# EAGLE design LED-Lamp-pth (EAGLE 7.5.0)
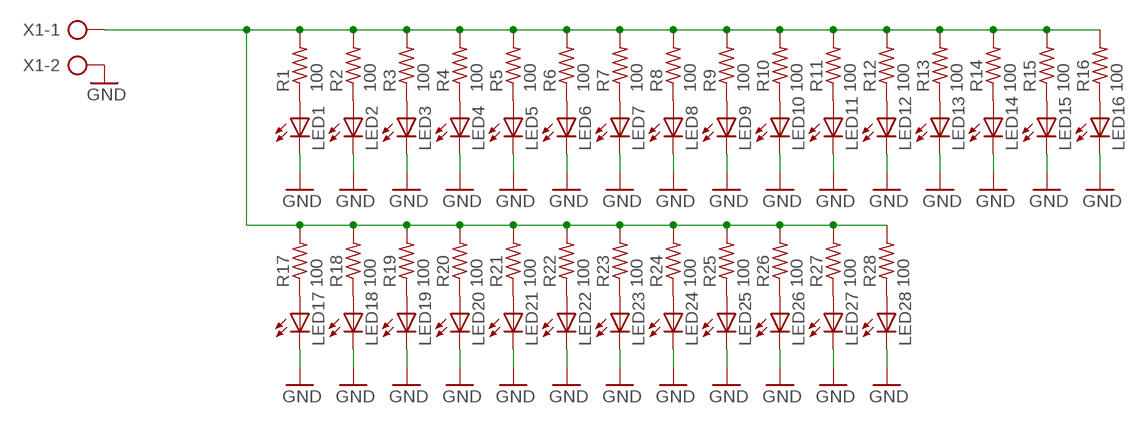
[diagram p0: schematic, sheet 1]

## Parts
LED1  LEDSML0805  [SML0805]
LED2  LEDSML0805  [SML0805]
LED3  LEDSML0805  [SML0805]
LED4  LEDSML0805  [SML0805]
LED5  LEDSML0805  [SML0805]
LED6  LEDSML0805  [SML0805]
LED7  LEDSML0805  [SML0805]
LED8  LEDSML0805  [SML0805]
LED9  LEDSML0805  [SML0805]
LED10  LEDSML0805  [SML0805]
LED11  LEDSML0805  [SML0805]
LED12  LEDSML0805  [SML0805]
LED13  LEDSML0805  [SML0805]
LED14  LEDSML0805  [SML0805]
LED15  LEDSML0805  [SML0805]
LED16  LEDSML0805  [SML0805]
LED17  LEDSML0805  [SML0805]
LED18  LEDSML0805  [SML0805]
LED19  LEDSML0805  [SML0805]
LED20  LEDSML0805  [SML0805]
LED21  LEDSML0805  [SML0805]
LED22  LEDSML0805  [SML0805]
LED23  LEDSML0805  [SML0805]
LED24  LEDSML0805  [SML0805]
LED25  LEDSML0805  [SML0805]
LED26  LEDSML0805  [SML0805]
LED27  LEDSML0805  [SML0805]
LED28  LEDSML0805  [SML0805]
R1  100  R-US_0207/7  [0207/7]
R2  100  R-US_0207/7  [0207/7]
R3  100  R-US_0207/7  [0207/7]
R4  100  R-US_0207/7  [0207/7]
R5  100  R-US_0207/7  [0207/7]
R6  100  R-US_0207/7  [0207/7]
R7  100  R-US_0207/7  [0207/7]
R8  100  R-US_0207/7  [0207/7]
R9  100  R-US_0207/7  [0207/7]
R10  100  R-US_0207/7  [0207/7]
R11  100  R-US_0207/7  [0207/7]
R12  100  R-US_0207/7  [0207/7]
R13  100  R-US_0207/7  [0207/7]
R14  100  R-US_0207/7  [0207/7]
R15  100  R-US_0207/7  [0207/7]
R16  100  R-US_0207/7  [0207/7]
R17  100  R-US_0207/7  [0207/7]
R18  100  R-US_0207/7  [0207/7]
R19  100  R-US_0207/7  [0207/7]
R20  100  R-US_0207/7  [0207/7]
R21  100  R-US_0207/7  [0207/7]
R22  100  R-US_0207/7  [0207/7]
R23  100  R-US_0207/7  [0207/7]
R24  100  R-US_0207/7  [0207/7]
R25  100  R-US_0207/7  [0207/7]
R26  100  R-US_0207/7  [0207/7]
R27  100  R-US_0207/7  [0207/7]
R28  100  R-US_0207/7  [0207/7]
X1  AK300/2  [AK300/2]

## Nets
GND: LED1.C LED2.C LED3.C LED4.C LED5.C LED6.C LED7.C LED8.C LED9.C LED10.C LED11.C LED12.C LED13.C LED14.C LED15.C LED16.C LED17.C LED18.C LED19.C LED20.C LED21.C LED22.C LED23.C LED24.C LED25.C LED26.C LED27.C LED28.C X1.2
N$1: LED1.A R1.1
N$2: LED2.A R2.1
N$3: LED3.A R3.1
N$4: LED4.A R4.1
N$5: R1.2 R2.2 R3.2 R4.2 R5.2 R6.2 R7.2 R8.2 R9.2 R10.2 R11.2 R12.2 R13.2 R14.2 R15.2 R16.2 R17.2 R18.2 R19.2 R20.2 R21.2 R22.2 R23.2 R24.2 R25.2 R26.2 R27.2 R28.2 X1.1
N$6: LED5.A R5.1
N$7: LED6.A R6.1
N$8: LED7.A R7.1
N$9: LED8.A R8.1
N$10: LED9.A R9.1
N$11: LED10.A R10.1
N$12: LED11.A R11.1
N$13: LED12.A R12.1
N$14: LED13.A R13.1
N$15: LED14.A R14.1
N$16: LED15.A R15.1
N$17: LED16.A R16.1
N$18: LED17.A R17.1
N$19: LED18.A R18.1
N$20: LED19.A R19.1
N$21: LED20.A R20.1
N$22: LED21.A R21.1
N$23: LED22.A R22.1
N$24: LED23.A R23.1
N$25: LED24.A R24.1
N$26: LED25.A R25.1
N$28: LED26.A R26.1
N$30: LED27.A R27.1
N$32: LED28.A R28.1

## Library data of the parts
LED1-LED28 = led:LED: LED OSRAM: - CHIPLED LG R971, LG N971, LY N971, LG Q971, LY Q971, LO R971, LY R971 LH N974, LH R974 LS Q976, LO Q976, LY Q976 LO Q996 - Hyper CHIPLED LW Q18S LB Q993, LB Q99A, LB R99A - SideLED LS A670, LO A670, LY A670, LG A670, LP A670 LB A673, LV A673, LT A673, LW A673 LH A674 LY A675 LS A676, LA A676, LO A676, LY A676, LW A676 LS A679, LY A679, LG A679 - Hyper Micro SIDELED® LS Y876, LA Y876, LO Y876, LY Y876 LT Y87S - SmartLED LW L88C, LW L88S LB L89C, LB L89S, LG L890 LS L89K, LO L89K, LY L89K LS L896, LA L896, LO L896, LY L896 - TOPLED LS T670, LO T670, LY T670, LG T670, LP T670 LSG T670, LSP T670, LSY T670, LOP T670, LYG T670 LG T671, LOG T671, LSG T671 LB T673, LV T673, LT T673, LW T673 LH T674 LS T676, LA T676, LO T676, LY T676, LB T676, LH T676, LSB T676, LW T676 LB T67C, LV T67C, LT T67C, LS T67K, LO T67K, LY T67K, LW E67C LS E67B, LA E67B, LO E67B, LY E67B, LB E67C, LV E67C, LT E67C LW T67C LS T679, LY T679, LG T679 LS T770, LO T770, LY T770, LG T770, LP T770 LB T773, LV T773, LT T773, LW T773 LH T774 LS E675, LA E675, LY E675, LS T675 LS T776, LA T776, LO T776, LY T776, LB T776 LHGB T686 LT T68C, LB T68C - Hyper Mini TOPLED® LB M676 - Mini TOPLED Santana® LG M470 LS M47K, LO M47K, LY M47K Source: http://www.osram.convergy.de LUXEON: - LUMILED® LXK2-PW12-R00, LXK2-PW12-S00, LXK2-PW14-U00, LXK2-PW14-V00 LXK2-PM12-R00, LXK2-PM12-S00, LXK2-PM14-U00 LXK2-PE12-Q00, LXK2-PE12-R00, LXK2-PE12-S00, LXK2-PE14-T00, LXK2-PE14-U00 LXK2-PB12-K00, LXK2-PB12-L00, LXK2-PB12-M00, LXK2-PB14-N00, LXK2-PB14-P00, LXK2-PB14-Q00 LXK2-PR12-L00, LXK2-PR12-M00, LXK2-PR14-Q00, LXK2-PR14-R00 LXK2-PD12-Q00, LXK2-PD12-R00, LXK2-PD12-S00 LXK2-PH12-R00, LXK2-PH12-S00 LXK2-PL12-P00, LXK2-PL12-Q00, LXK2-PL12-R00 Source: www.luxeon.com KINGBRIGHT: KA-3528ASYC Source: www.kingbright.com
R1-R28 = rcl:R-US_: RESISTOR, American symbol
X1 = con-ptr500:AK300/2: CONNECTOR; OC_FARNELL: unknown; OC_NEWARK: unknown

## Board
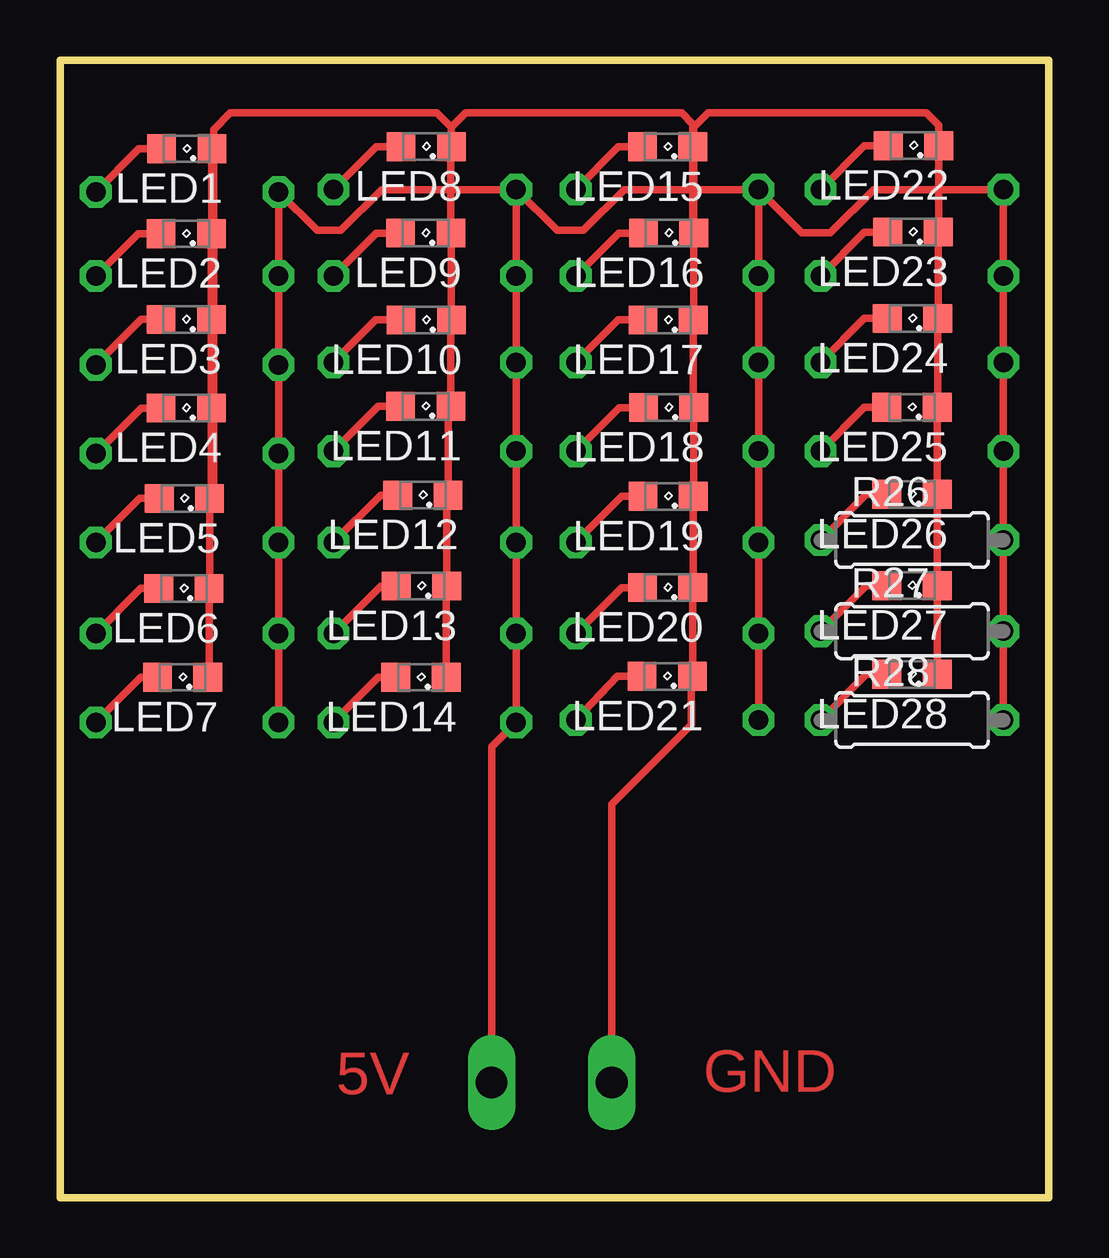
[diagram p1: board, top side]
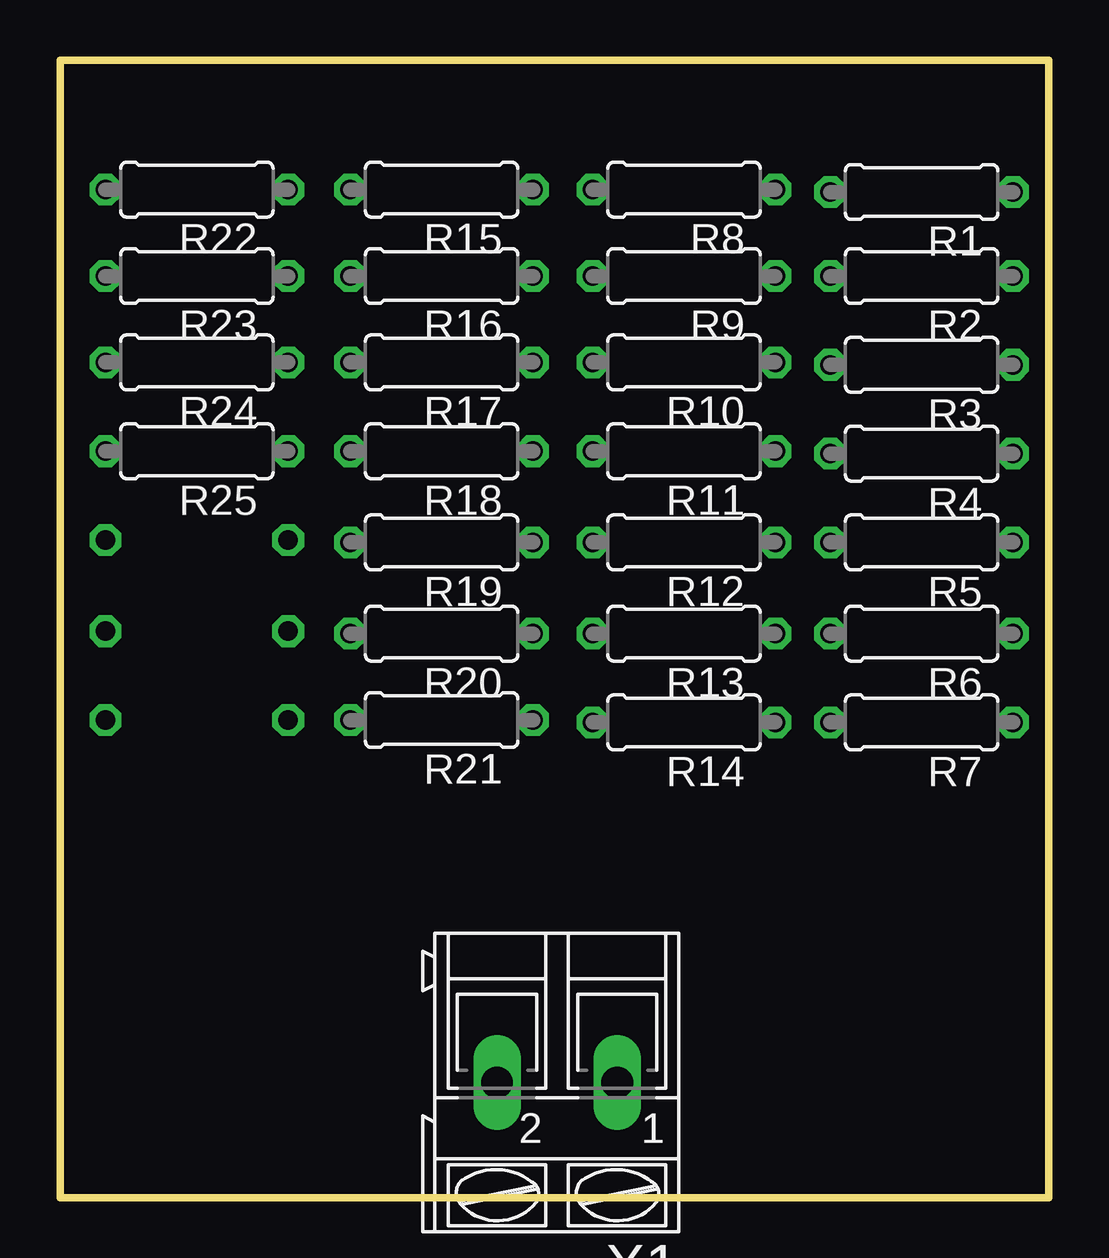
[diagram p2: board, bottom side, seen from below]

Size 41.2 x 47.4 mm. Coordinates in mm from the lower left corner, seen from the top.
Outline: 0,0 41.2,0 41.2,47.4 0,47.4 0,0
Copper layers (1*16): Top 0.035mm / dielectric 1.5mm / Bottom 0.035mm
Design rules "default": minimum track width 10mil, minimum drill 24mil, track to track 8mil, track to pad 8mil, pad to pad 8mil, via to via 8mil, smd to smd 8mil, copper to edge 40mil, drill to drill 8mil, minimum pad ring 10mil, minimum via ring 8mil, stop-mask expansion 4mil, vias tented up to drill 0mil, thermal gap 10mil

### Footprints (pad centres in the part's own frame; a part is rotated, then mirrored left to right if it is on the bottom)
SML0805 = smd 1.2 x 1.2: A 1.05,0; C -1.05,0
0207/7 = drill 0.813 octagon: 1 -3.81,0; 2 3.81,0
AK300/2 = drill 1.321 long: 1 -2.515,0; 2 2.489,0

### Placement (x,y rotation side)
LED1  5.28,43.7 180 top
LED2  5.26,40.16 180 top
LED3  5.26,36.59 180 top
LED4  5.26,32.9 180 top
LED5  5.18,29.13 180 top
LED6  5.16,25.38 180 top
LED7  5.11,21.68 180 top
LED8  15.26,43.79 180 top
LED9  15.24,40.19 180 top
LED10  15.26,36.57 180 top
LED11  15.24,32.97 180 top
LED12  15.12,29.27 180 top
LED13  15.06,25.48 180 top
LED14  15.04,21.68 180 top
LED15  25.32,43.78 180 top
LED16  25.36,40.19 180 top
LED17  25.34,36.57 180 top
LED18  25.36,32.92 180 top
LED19  25.34,29.22 180 top
LED20  25.32,25.42 180 top
LED21  25.3,21.72 180 top
LED22  35.56,43.83 180 top
LED23  35.54,40.23 180 top
LED24  35.52,36.63 180 top
LED25  35.5,32.93 180 top
LED26  35.5,29.3 180 top
LED27  35.5,25.5 180 top
LED28  35.5,21.8 180 top
R1  5.3,41.9 180 bottom
R2  5.3,38.4 180 bottom
R3  5.3,34.7 180 bottom
R4  5.3,31 180 bottom
R5  5.3,27.3 180 bottom
R6  5.3,23.5 180 bottom
R7  5.3,19.8 180 bottom
R8  15.2,42 180 bottom
R9  15.2,38.4 180 bottom
R10  15.2,34.8 180 bottom
R11  15.2,31.1 180 bottom
R12  15.2,27.3 180 bottom
R13  15.2,23.5 180 bottom
R14  15.2,19.8 180 bottom
R15  25.3,42 180 bottom
R16  25.3,38.4 180 bottom
R17  25.3,34.8 180 bottom
R18  25.3,31.1 180 bottom
R19  25.3,27.3 180 bottom
R20  25.3,23.5 180 bottom
R21  25.3,19.9 180 bottom
R22  35.5,42 180 bottom
R23  35.5,38.4 180 bottom
R24  35.5,34.8 180 bottom
R25  35.5,31.1 180 bottom
R26  35.5,27.4 0 top
R27  35.5,23.6 0 top
R28  35.5,19.9 0 top
X1  20.5,4.8 180 bottom

### Tracks (layer width: path | path; a pad name or v marks a point on that pad's centre or on a via)
GND
  Top 0.305: LED1.C 6.33,40.18 LED2.C LED3.C LED4.C 6.31,29.21 | 6.31,29.21 LED5.C 6.23,25.4 LED6.C 6.21,21.73 LED7.C | LED8.C 16.29,43.79 LED9.C 16.31,40.19 LED10.C 16.29,36.57 LED11.C 16.17,32.97 LED12.C 16.11,29.27 LED13.C 16.09,25.48 LED14.C | 26.41,36.57 LED17.C 26.39,32.92 LED18.C 26.41,29.22 LED19.C 26.39,25.42 LED20.C 26.37,21.72 LED21.C 26.3,21.67 26.3,19.7 22.99,16.39 X1.2 | 26.41,36.57 LED16.C 26.37,40.19 LED15.C 26.37,44.73 25.9,45.2 16.9,45.2 16.3,44.6 | LED28.C LED27.C LED26.C LED25.C 36.57,32.93 LED24.C 36.59,36.63 LED23.C 36.61,40.23 LED22.C 36.61,44.69 36.1,45.2 27,45.2 26.4,44.6 LED17.C 26.41,36.57 | 6.31,29.21 6.4,29.3 6.4,44.5 7.1,45.2 15.7,45.2 16.3,44.6 | LED8.C | 16.3,44.6 16.31,44.59 LED8.C
N$1
  Top 0.305: R1.1 3.29,43.7 LED1.A
N$2
  Top 0.305: R2.1 3.25,40.16 LED2.A
N$3
  Top 0.305: R3.1 3.38,36.59 LED3.A
N$4
  Top 0.305: R4.1 3.39,32.9 LED4.A
N$5
  Top 0.305: R7.2 R6.2 R5.2 R4.2 R3.2 R2.2 R1.2 10.71,40.3 11.7,40.3 13.4,42 R8.2 | R8.2 R9.2 R10.2 R11.2 R12.2 R13.2 R14.2 17.98,18.77 X1.1 | R28.2 R27.2 R26.2 R25.2 R24.2 R23.2 R22.2 33.9,42 32.1,40.2 30.91,40.2 R15.2 | R21.2 R20.2 R19.2 R18.2 R17.2 R16.2 R15.2 | R8.2 20.71,40.3 21.8,40.3 23.5,42 R15.2
N$6
  Top 0.305: R5.1 3.32,29.13 LED5.A
N$7
  Top 0.305: R6.1 3.37,25.38 LED6.A
N$8
  Top 0.305: R7.1 3.37,21.68 LED7.A
N$9
  Top 0.305: R8.1 13.18,43.79 LED8.A
N$10
  Top 0.305: R9.1 13.18,40.19 LED9.A
N$11
  Top 0.305: R10.1 13.16,36.57 LED10.A
N$12
  Top 0.305: R11.1 13.26,32.97 LED11.A
N$13
  Top 0.305: R12.1 13.36,29.27 LED12.A
N$14
  Top 0.305: R13.1 13.37,25.48 LED13.A
N$15
  Top 0.305: R14.1 13.27,21.68 LED14.A
N$16
  Top 0.305: R15.1 23.27,43.78 LED15.A
N$17
  Top 0.305: R16.1 23.28,40.19 LED16.A
N$18
  Top 0.305: R17.1 23.26,36.57 LED17.A
N$19
  Top 0.305: R18.1 23.31,32.92 LED18.A
N$20
  Top 0.305: R19.1 23.41,29.22 LED19.A
N$21
  Top 0.305: R20.1 23.41,25.42 LED20.A
N$22
  Top 0.305: R21.1 23.21,21.72 LED21.A
N$23
  Top 0.305: R22.1 33.52,43.83 LED22.A
N$24
  Top 0.305: R23.1 33.52,40.23 LED23.A
N$25
  Top 0.305: R24.1 33.52,36.63 LED24.A
N$26
  Top 0.305: R25.1 33.52,32.93 LED25.A
N$28
  Top 0.305: R26.1 33.59,29.3 LED26.A
N$30
  Top 0.305: R27.1 33.59,25.5 LED27.A
N$32
  Top 0.305: R28.1 33.59,21.8 LED28.A

### Text on the board
Top: 5V | GND